# EAGLE design Stethi (EAGLE 7.4.0)
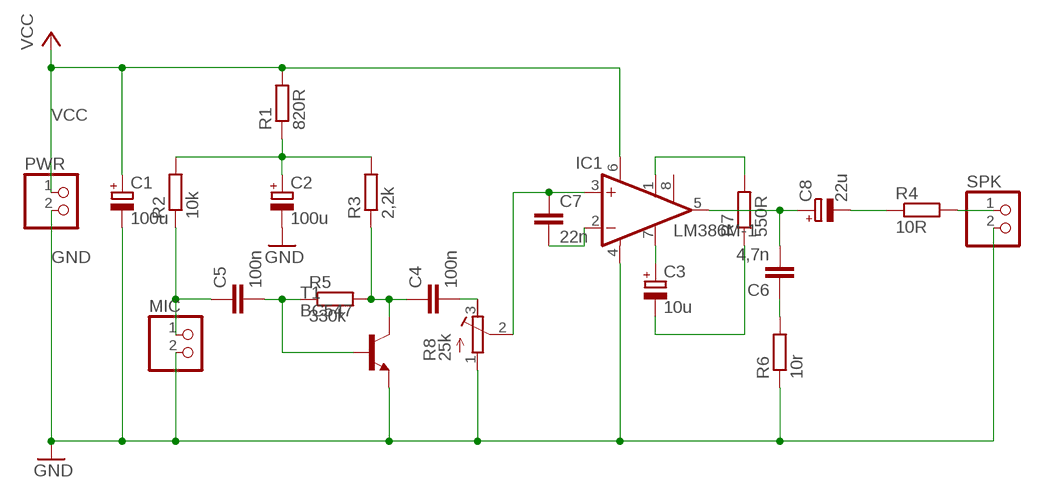
[diagram p0: schematic, sheet 1]

## Parts
C1  100u  CPOL-EUA/3216-18W  [A/3216-18W]
C2  100u  CPOL-EUA/3216-18W  [A/3216-18W]
C3  10u  CPOL-EUA/3216-18W  [A/3216-18W]
C4  100n  C-EUC0805K  [C0805K]
C5  100n  C-EUC0805K  [C0805K]
C6  4,7n  C-EUC0805K  [C0805K]
C7  22n  C-EUC0805K  [C0805K]
C8  22u  CPOL-EUA/3216-18W  [A/3216-18W]
IC1  LM386M-1  [SO08]
MIC  PINHD-1X2  [1X02]
PWR  PINHD-1X2  [1X02]
R1  820R  R-EU_R0805  [R0805]
R2  10k  R-EU_R0805  [R0805]
R3  2,2k  R-EU_R0805  [R0805]
R4  10R  R-EU_R0805  [R0805]
R5  330k  R-EU_R0805  [R0805]
R6  10r  R-EU_R0805  [R0805]
R7  550R  R-EU_R0805  [R0805]
R8  25k  R-TRIMM5X  [RTRIM5X]
SPK  PINHD-1X2  [1X02]
T1  BC547  BC847-NPN-SOT23-BEC  [SOT23-BEC]

## Nets
GND: C1.- C2.- IC1.4(GND) MIC.2 PWR.2 R6.1 R8.1(A) SPK.2 T1.E
N$1: C2.+ R1.1 R2.2 R3.2
N$2: C5.1 MIC.1 R2.1
N$3: C7.2 IC1.2(-IN)
N$4: C7.1 IC1.3(+IN) R8.2(S)
N$5: C5.2 R5.1 T1.B
N$6: C4.2 R8.3(E)
N$7: C4.1 R3.1 R5.2 T1.C
N$8: C6.1 R6.2
N$9: C3.+ IC1.7(BYPASS)
N$10: R4.2 SPK.1
N$11: C6.2 C8.+ IC1.5(OUT)
N$12: C8.- R4.1
N$13: IC1.1(GAIN) R7.2
N$14: C3.- R7.1
VCC: C1.+ IC1.6(VS) PWR.1 R1.2
Unconnected: IC1.8(GAIN)

## Library data of the parts
C1-C3 C8 = resistor:CPOL-EU: POLARIZED CAPACITOR, European symbol
C4-C7 = resistor:C-EU: CAPACITOR, European symbol
IC1 = linear:LM386?-*: Low Voltage Audio Power Amplifier Source: http://cache.national.com/ds/LM/LM386.pdf
MIC PWR SPK = pinhead:PINHD-1X2: PIN HEADER
R1-R7 = resistor:R-EU_: RESISTOR, European symbol
R8 = rcl:R-TRIMM: Trimm resistor
T1 = transistor:*-NPN-: NPN Transistror BF959 corrected 2008.03.06

## Board
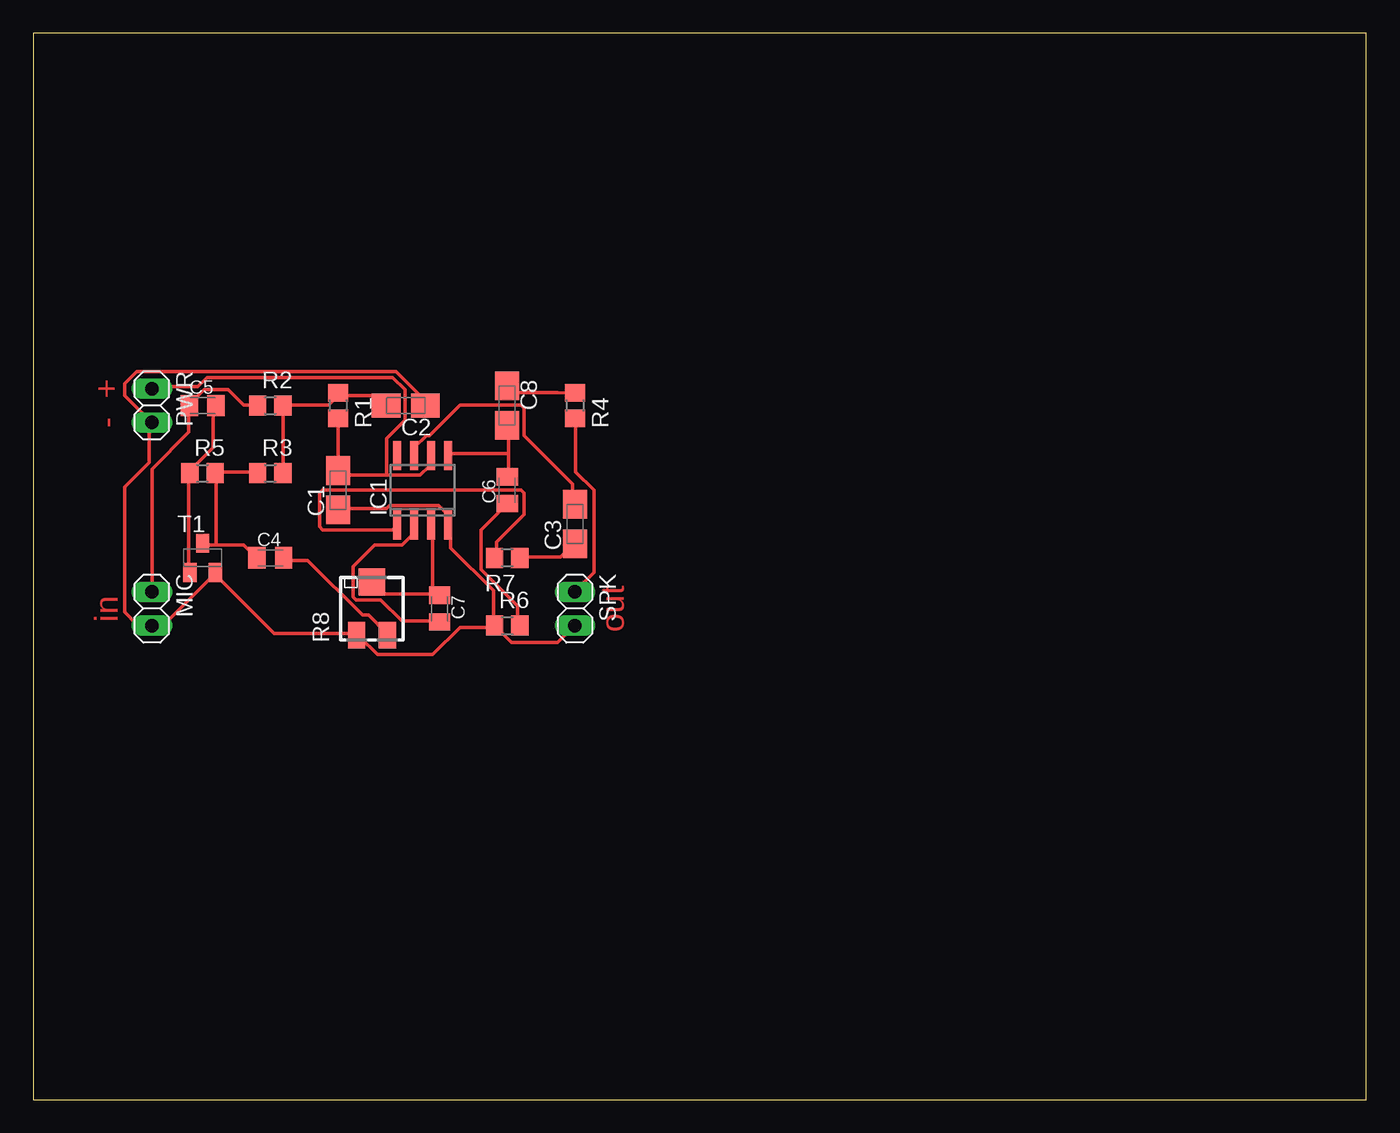
[diagram p1: board, top side]

Size 100 x 80 mm. Coordinates in mm from the lower left corner, seen from the top.
Outline: 0,0 100,0 100,80 0,80 0,0
Copper layers (1*16): Top 0.035mm / dielectric 1.5mm / Bottom 0.035mm
Design rules "default *": minimum track width 10mil, minimum drill 24mil, track to track 0.15mm, track to pad 0.15mm, pad to pad 0.15mm, via to via 0.15mm, smd to smd 0.15mm, copper to edge 40mil, drill to drill 8mil, minimum pad ring 10mil, minimum via ring 8mil, stop-mask expansion 4mil, vias tented up to drill 0mil, thermal gap 10mil

### Footprints (pad centres in the part's own frame; a part is rotated, then mirrored left to right if it is on the bottom)
A/3216-18W = smd 2.15 x 1.8: + 1.475,0; - -1.475,0
C0805K = smd 1.3 x 1.6: 1 -1,0; 2 1,0
SO08 = smd 0.6 x 2.2: 1 -1.905,-2.6; 2 -0.635,-2.6; 3 0.635,-2.6; 4 1.905,-2.6; 5 1.905,2.6; 6 0.635,2.6; 7 -0.635,2.6; 8 -1.905,2.6
1X02 = drill 1.016 long: 1 -1.27,0; 2 1.27,0
R0805 = smd 1.3 x 1.5: 1 -0.95,0; 2 0.95,0
RTRIM5X = smd 1.3 x 2: 1 -1.15,-2; 3 1.15,-2 | smd 2 x 2: 2 0,2
SOT23-BEC = smd 1 x 1.4: B -0.95,-1.1; C 0,1.1; E 0.95,-1.1

### Placement (x,y rotation side)
C1  22.86,45.72 90 top
C2  27.94,52.07 180 top
C3  40.64,43.18 90 top
C4  17.78,40.64 0 top
C5  12.7,52.07 0 top
C6  35.56,45.72 90 top
C7  30.48,36.83 270 top
C8  35.56,52.07 270 top
IC1  29.21,45.72 0 top
MIC  8.89,36.83 270 top
PWR  8.89,52.07 270 top
R1  22.86,52.07 270 top
R2  17.78,52.07 0 top
R3  17.78,46.99 0 top
R4  40.64,52.07 270 top
R5  12.7,46.99 0 top
R6  35.56,35.56 0 top
R7  35.56,40.64 180 top
R8  25.4,36.83 0 top
SPK  40.64,36.83 270 top
T1  12.7,40.64 0 top

### Tracks (layer width: path | path; a pad name or v marks a point on that pad's centre or on a via)
GND
  Top 0.254: 7.77,35.66 9.83,35.66 13.49,39.32 T1.E 13.72,39.32 18.06,34.98 24.23,34.98 R8.1 24.46,34.75 25.83,33.38 29.95,33.38 32,35.43 34.52,35.43 R6.1 | C2.- 29.26,52.12 29.26,52.58 27.2,54.63 7.77,54.63 6.86,53.72 6.86,52.81 8.69,50.98 PWR.2 8.69,50.75 8.69,47.78 6.86,45.95 6.86,36.58 7.77,35.66 | 7.77,35.66 MIC.2 | C1.- 22.86,44.35 26.52,44.35 26.75,44.58 30.4,44.58 31.09,43.89 31.09,43.2 IC1.4 31.32,42.98 31.32,41.38 34.52,38.18 34.52,35.66 R6.1 | R6.1 34.75,35.43 35.89,34.29 39.32,34.29 40.46,35.43 SPK.2
N$1
  Top 0.254: R3.2 18.75,47.09 18.75,51.89 R2.2 18.75,52.12 22.17,52.12 22.86,52.81 | 22.86,52.81 25.6,52.81 26.29,52.12 C2.+ | 22.86,52.81 R1.1
N$2
  Top 0.254: R2.1 16.69,52.12 15.77,52.12 14.63,53.26 12.8,53.26 11.66,52.12 C5.1 11.66,51.89 11.66,50.06 8.91,47.32 8.91,38.18 MIC.1
N$3
  Top 0.254: IC1.2 28.57,42.52 27.66,41.6 25.6,41.6 24,40.01 24,37.72 24.23,37.49 26.06,37.49 27.66,35.89 30.4,35.89 C7.2
N$4
  Top 0.254: 29.95,37.95 26.29,37.95 25.6,38.63 R8.2 | 29.95,37.95 30.4,37.95 C7.1 29.95,37.95 | 29.95,37.95 29.95,42.98 IC1.3
N$5
  Top 0.254: T1.B 11.66,39.55 11.66,46.86 R5.1 11.66,47.09 13.49,48.92 13.49,51.89 C5.2
N$6
  Top 0.254: C4.2 18.97,40.46 20.57,40.46 24.69,36.35 25.15,36.35 26.52,34.98 R8.3
N$7
  Top 0.254: R3.1 16.69,47.09 13.72,47.09 R5.2 13.72,46.86 13.72,41.6 | 13.72,41.6 15.77,41.6 16.69,40.69 C4.1 | 13.72,41.6 12.8,41.6 T1.C
N$8
  Top 0.254: R6.2 36.35,35.66 36.35,37.03 33.6,39.78 33.6,42.75 35.43,44.58 C6.1
N$9
  Top 0.254: IC1.7 28.57,48.92 29.49,49.84 29.72,49.84 32,52.12 36.58,52.12 36.8,51.89 36.8,49.84 40.46,46.18 40.46,44.81 C3.+
N$10
  Top 0.254: R4.2 40.69,50.98 40.69,47.09 42.06,45.72 42.06,39.55 40.69,38.18 SPK.1
N$11
  Top 0.254: 35.66,48.46 35.66,50.52 C8.+ | 35.66,48.46 35.66,46.86 C6.2 | 35.66,48.46 31.32,48.46 IC1.5
N$12
  Top 0.254: R4.1 39.32,53.03 36.12,53.03 35.66,53.49 C8.-
N$13
  Top 0.254: R7.2 34.75,40.69 34.75,41.83 36.8,43.89 36.8,45.49 36.58,45.72 21.72,45.72 21.49,45.49 21.49,42.98 21.72,42.75 26.98,42.75 27.2,42.98 IC1.1
N$14
  Top 0.254: R7.1 36.58,40.69 39.55,40.69 40.46,41.6 C3.-
VCC
  Top 0.254: 26.52,46.86 23.09,46.86 22.86,47.09 C1.+ R1.2 | 26.52,46.86 29.03,46.86 29.72,47.55 29.72,48.23 IC1.6 | 26.52,46.86 26.52,49.61 27.89,50.98 27.89,53.26 26.98,54.18 13.03,54.18 12.34,53.49 8.91,53.49 PWR.1

### Text on the board
Top: + | - | in | out